# EAGLE schematic XOrduino2 (EAGLE 6.2)

## Sheet 1 of 2
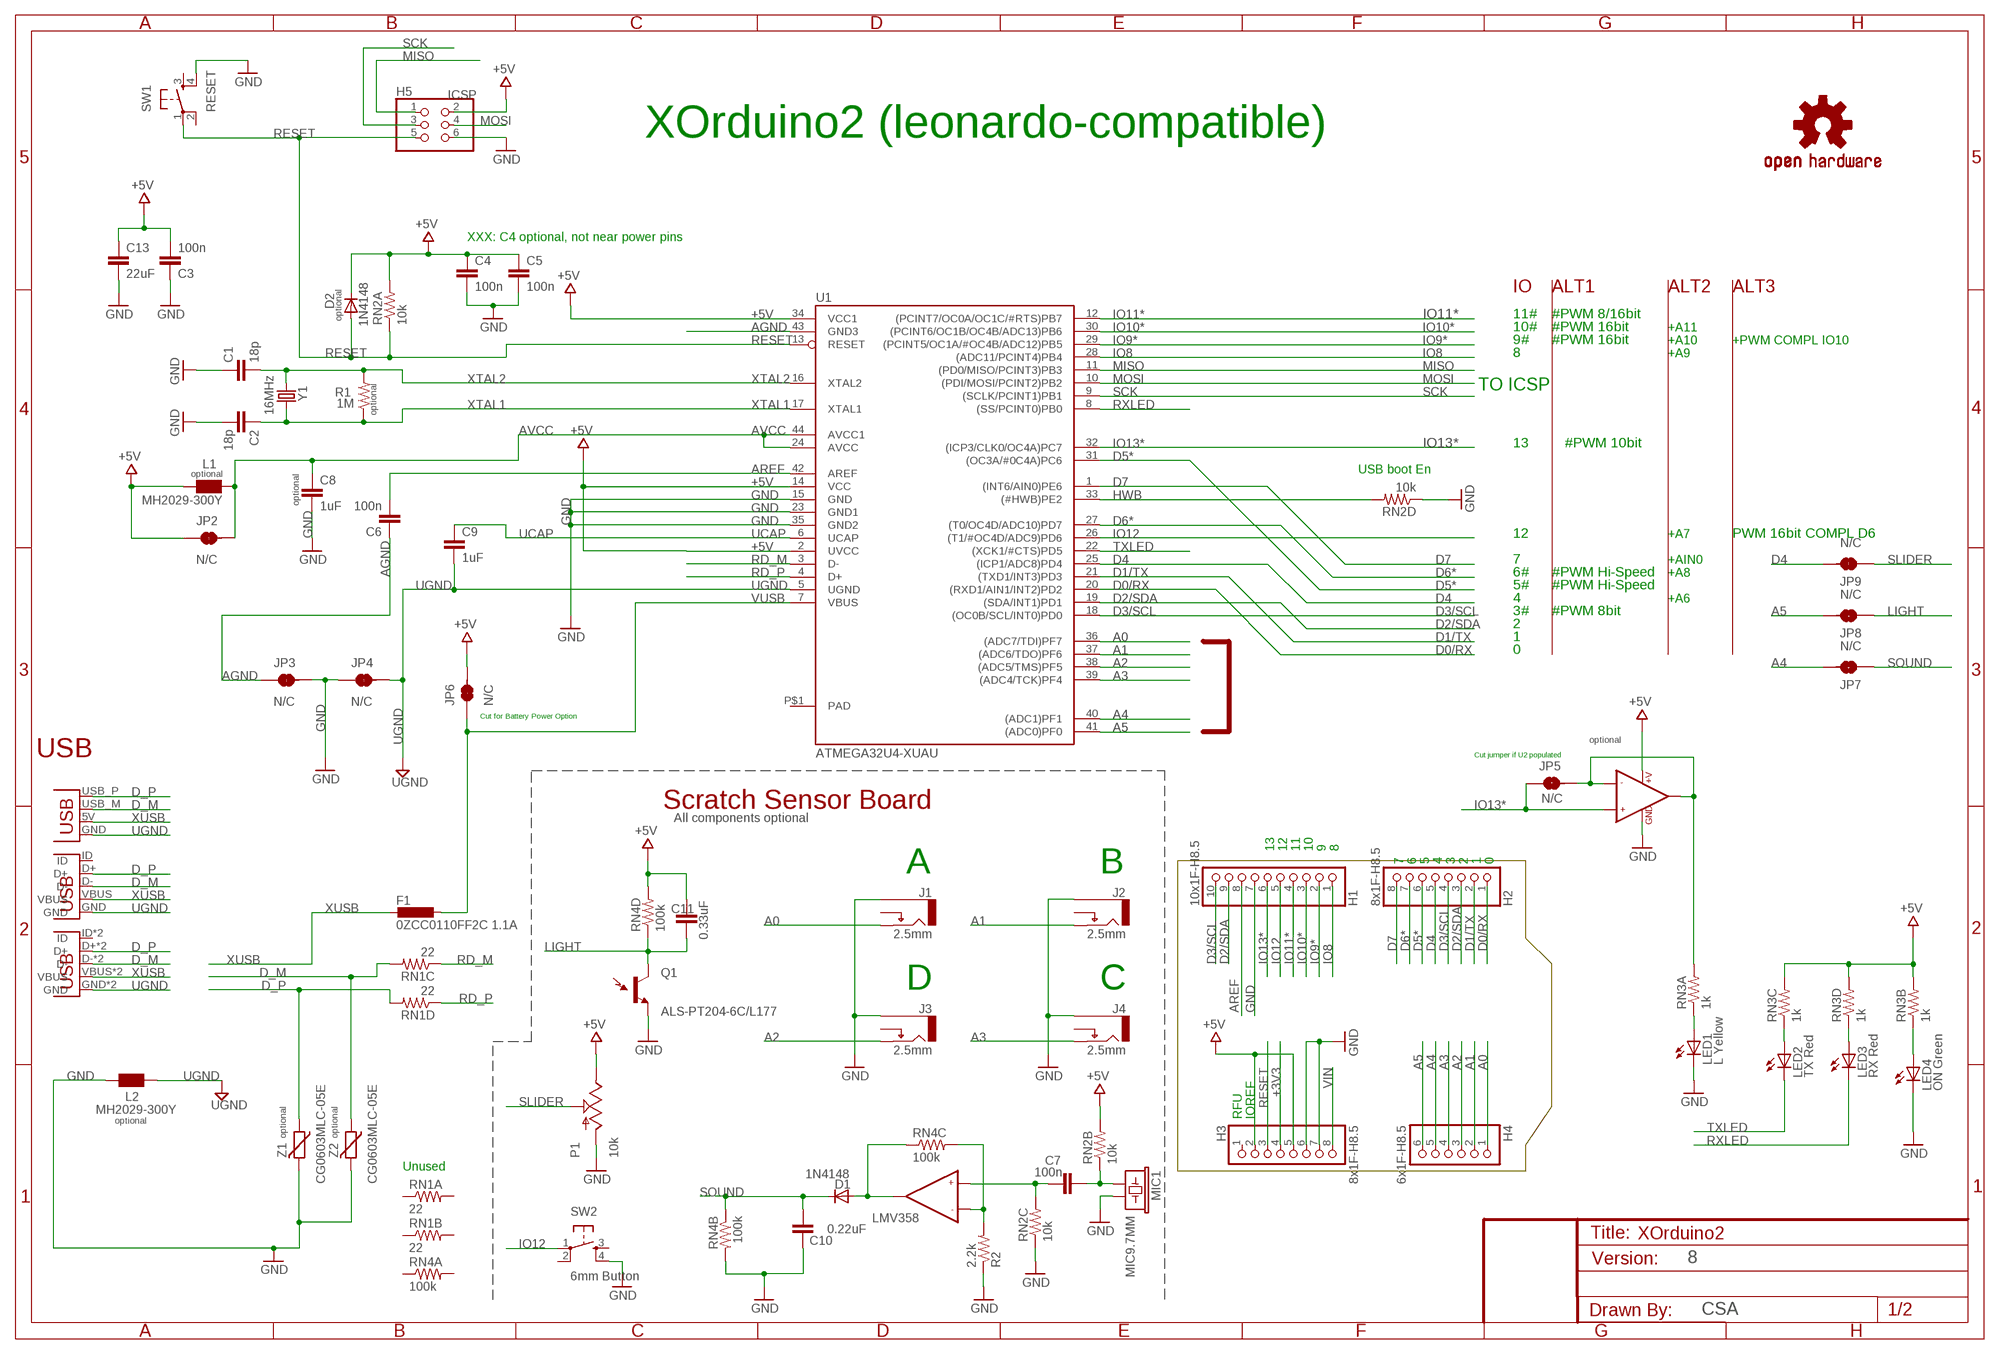
[diagram p0: schematic, sheet 1]

### Parts
C1  18p  CAP0805  [0805]
C2  18p  CAP0805  [0805]
C3  100n  CAP0805  [0805]
C4  100n  CAP0805  [0805]
C5  100n  CAP0805  [0805]
C6  100n  CAP0805  [0805]
C7  100n  CAP0805  [0805]
C8  1uF  CAP0805  [0805]
C9  1uF  CAP0805  [0805]
C10  0.22uF  CAP0805  [0805]
C11  0.33uF  CAP0805  [0805]
C13  22uF  CAP1206  [1206]
D1  1N4148  DIODE1N4148  [DIODE-1N4148]
D2  1N4148  DIODE1N4148  [DIODE-1N4148]
F1  0ZCC0110FF2C 1.1A  L-EUL1812  [L1812]
H1  10x1F-H8.5  PINHD-1X10  [1X10]
H2  8x1F-H8.5  PINHD-1X8  [1X08]
H3  8x1F-H8.5  PINHD-1X8  [1X08]
H4  6x1F-H8.5  PINHD-1X6  [1X06]
H5  ICSP  PINHD-2X3  [2X03]
J1  2.5mm  AUDIO-JACK  [MJ-3523-SMT]
J2  2.5mm  AUDIO-JACK  [MJ-3523-SMT]
J3  2.5mm  AUDIO-JACK  [MJ-3523-SMT]
J4  2.5mm  AUDIO-JACK  [MJ-3523-SMT]
JP2  N/C  SOLDERJUMPERNOCONFLICT  [SJ-2S-TRACE-NOCONFLICT]
JP3  N/C  SOLDERJUMPERNOCONFLICT  [SJ-2S-TRACE-NOCONFLICT]
JP4  N/C  SOLDERJUMPERNOCONFLICT  [SJ-2S-TRACE-NOCONFLICT]
JP5  N/C  SOLDERJUMPERNOCONFLICT  [SJ-2S-TRACE-NOCONFLICT]
JP6  N/C  SOLDERJUMPERNOCONFLICT  [SJ-2S-TRACE-NOCONFLICT]
JP7  N/C  SOLDERJUMPERBOT-VIA-NOCONFLICT  [SJ-2S-BOT-TRACE-VIA-NOCONFLICT]
JP8  N/C  SOLDERJUMPERBOT-VIA-NOCONFLICT  [SJ-2S-BOT-TRACE-VIA-NOCONFLICT]
JP9  N/C  SOLDERJUMPERBOT-NOCONFLICT  [SJ-2S-BOT-TRACE-NOCONFLICT]
L1  MH2029-300Y  WE-CBF_0805  [0805]
L2  MH2029-300Y  WE-CBF_0805  [0805]
LED1  L Yellow  LED0805  [LED0805]
LED2  TX Red  LED0805  [LED0805]
LED3  RX Red  LED0805  [LED0805]
LED4  ON Green  LED0805  [LED0805]
MIC1  MIC9.7MM  [MIC-9.7MM]
P1  10k  POT  [P091N]
Q1  ALS-PT204-6C/L177  [LED3MM-KIT]
R1  1M  RESISTOR0805-RES  [0805]
R2  2.2k  RESISTOR0805-RES  [0805]
RN1  22  RESISTOR-ARRAYCRA06S  [CRA06S]
RN2  10k  RESISTOR-ARRAYCRA06S  [CRA06S]
RN3  1k  RESISTOR-ARRAYCRA06S  [CRA06S]
RN4  100k  RESISTOR-ARRAYCRA06S  [CRA06S]
SW1  RESET  TAC_SWITCHPTH  [TACTILE-PTH]
SW2  6mm Button  TAC_SWITCHPTH  [TACTILE-PTH]
U1  ATMEGA32U4-XUAU  [TQFP44-PAD]
U2  LMV358  [SO08]
U$5  OSHW-LOGOL  [OSHW-LOGO-L]
X1  USBPCB  [USB-A-PCB]
X2  USBMINIB  [USB-MB-H2]
X3  USBMICROB-VIA  [USB-MICROB-VIA]
Y1  16MHz  CRYSTALHC49US  [HC49US]
Z1  CG0603MLC-05E  VARISTORCN0603  [CT/CN0603]
Z2  CG0603MLC-05E  VARISTORCN0603  [CT/CN0603]

### Nets
+3V3: H3.4
+5V [power]: C3.2 C4.1 C5.1 C11.1 C13.1 D2.C H3.2 H3.5 H5.2 JP2.1 JP6.2 L1.1 P1.1(E) RN2.7 RN2.8 RN3.5 RN3.6 RN3.7 RN4.5 U1.2(UVCC) U1.14(VCC) U1.34(VCC1) U2.8(+V) ; also sheet 2
A0: H4.1 J1.2(TIP) U1.36((ADC7/TDI)PF7)
A1: H4.2 J2.2(TIP) U1.37((ADC6/TDO)PF6)
A2: H4.3 J3.2(TIP) U1.38((ADC5/TMS)PF5)
A3: H4.4 J4.2(TIP) U1.39((ADC4/TCK)PF4)
A4: H4.5 JP7.2 U1.40((ADC1)PF1)
A5: H4.6 JP8.2 U1.41((ADC0)PF0)
AGND: C6.1 JP3.1 U1.43(GND3)
AREF [aref]: C6.2 H1.8 U1.42(AREF)
AVCC: C8.1 JP2.2 L1.2 U1.24(AVCC) U1.44(AVCC1)
D0/RX: H2.1 U1.20((RXD1/AIN1/INT2)PD2) ; also sheet 2
D1/TX: H2.2 U1.21((TXD1/INT3)PD3) ; also sheet 2
D2/SDA: H1.9 H2.3 U1.19((SDA/INT1)PD1) ; also sheet 2
D3/SCL: H1.10 H2.4 U1.18((OC0B/SCL/INT0)PD0)
D4: H2.5 JP9.2 U1.25((ICP1/ADC8)PD4)
D5*: H2.6 U1.31((OC3A/#0C4A)PC6) ; also sheet 2
D6*: H2.7 U1.27((T0/OC4D/ADC10)PD7) ; also sheet 2
D7: H2.8 U1.1((INT6/AIN0)PE6) ; also sheet 2
D_M: RN1.6 X1.USB_M(D-) X2.D- X3.D- X3.D-_VIA(D-) Z2.1
D_P: RN1.5 X1.USB_P(D+) X2.D+ X3.D+ X3.D+_VIA(D+) Z1.1
GND [gnd]: C1.1 C2.2 C3.1 C4.2 C5.2 C8.2 C10.1 C13.2 H1.7 H3.6 H3.7 H5.6 J1.1(SLEEVE) J2.1(SLEEVE) J3.1(SLEEVE) J4.1(SLEEVE) JP3.2 JP4.1 L2.2 LED1.C LED4.C MIC1.2 P1.3(A) Q1.A(E1) R2.1 RN2.3 RN2.4 RN4.7 SW1.4 SW2.4 U1.15(GND) U1.23(GND1) U1.35(GND2) U2.4(GND) Z1.2 Z2.2 ; also sheet 2
HWB: RN2.5 U1.33((#HWB)PE2)
IO8: H1.1 U1.28((ADC11/PCINT4)PB4) ; also sheet 2
IO9*: H1.2 U1.29((PCINT5/OC1A/#OC4B/ADC12)PB5) ; also sheet 2
IO10*: H1.3 U1.30((PCINT6/OC1B/OC4B/ADC13)PB6) ; also sheet 2
IO11*: H1.4 U1.12((PCINT7/OC0A/OC1C/#RTS)PB7) ; also sheet 2
IO12: H1.5 SW2.1 U1.26((T1/#OC4D/ADC9)PD6)
IO13*: H1.6 JP5.1 U1.32((ICP3/CLK0/OC4A)PC7) U2.3(+IN1)
IO13_MIRROR: JP5.2 RN3.8 U2.1(OUT1) U2.2(-IN1)
LED1_ANODE: LED1.A RN3.1
LED2_ANODE: LED2.A RN3.3
LED3_ANODE: LED3.A RN3.4
LED4_ANODE: LED4.A RN3.2
LIGHT: C11.2 JP8.1 JP8.VIA6 Q1.K(C1) RN4.4
MIC_IN: C7.1 MIC1.1 RN2.2
MISO: H5.1 U1.11((PD0/MISO/PCINT3)PB3)
MOSI: H5.4 U1.10((PDI/MOSI/PCINT2)PB2)
OPAMP1_M: R2.2 RN4.6 U2.6(-IN2)
OPAMP1_OUT: D1.A RN4.3 U2.7(OUT2)
OPAMP1_P: C7.2 RN2.6 U2.5(+IN2)
RD_M: RN1.3 U1.3(D-)
RD_P: RN1.4 U1.4(D+)
RESET: D2.A H3.3 H5.5 RN2.1 SW1.1 U1.13(RESET)
RXLED: LED3.C U1.8((SS/PCINT0)PB0)
SCK: H5.3 U1.9((SCLK/PCINT1)PB1)
SLIDER: JP9.1 P1.2(S)
SOUND: C10.2 D1.C JP7.1 JP7.VIA6 RN4.2
TXLED: LED2.C U1.22((XCK1/#CTS)PD5)
UCAP: C9.1 U1.6(UCAP)
UGND [gnd]: C9.2 JP4.2 L2.1 U1.5(UGND) X1.GND X2.GND X3.GND X3.GND_VIA(GND)
VIN [power]: H3.8 ; also sheet 2
VUSB [power]: F1.1 JP6.1 U1.7(VBUS) ; also sheet 2
XTAL1: C2.1 R1.1 U1.17(XTAL1) Y1.2
XTAL2: C1.2 R1.2 U1.16(XTAL2) Y1.1
XUSB [usbvcc]: F1.2 X1.5V(VBUS) X2.VBUS X3.VBUS X3.VBUS_VIA(VBUS)
Unconnected: H3.1 J1.10(SW) J2.10(SW) J3.10(SW) J4.10(SW) RN1.1 RN1.2 RN1.7 RN1.8 RN4.1 RN4.8 SW1.2 SW1.3 SW2.2 SW2.3 X2.ID X3.ID X3.ID_VIA(ID)

### Notes on the sheet
- XOrduino2 (leonardo-compatible)
- XXX: C4 optional, not near power pins
- IO | ALT1 | ALT2 | ALT3
- optional | 11# | #PWM 8/16bit
- 10# | #PWM 16bit | +A11
- 9# | #PWM 16bit | +A10 | +PWM COMPL IO10
- 8 | +A9
- TO ICSP
- optional
- 13 | #PWM 10bit
- USB boot En
- optional
- optional
- 12 | +A7 | PWM 16bit COMPL D6
- 7 | +AIN0
- 6# | #PWM Hi-Speed | +A8
- 5# | #PWM Hi-Speed
- 4 | +A6
- 3# | #PWM 8bit
- 2
- 1
- 0
- Cut for Battery Power Option
- optional
- USB | Cut jumper if U2 populated
- Scratch Sensor Board
- All components optional
- 13 | 12 | 11 | 10 | 9 | 8
- 7 | 6 | 5 | 4 | 3 | 2 | 1 | 0
- A | B
- D | C
- RFU | IOREF
- optional
- optional | optional
- Unused
- LMV358
- 8
- CSA

## Sheet 2 of 2
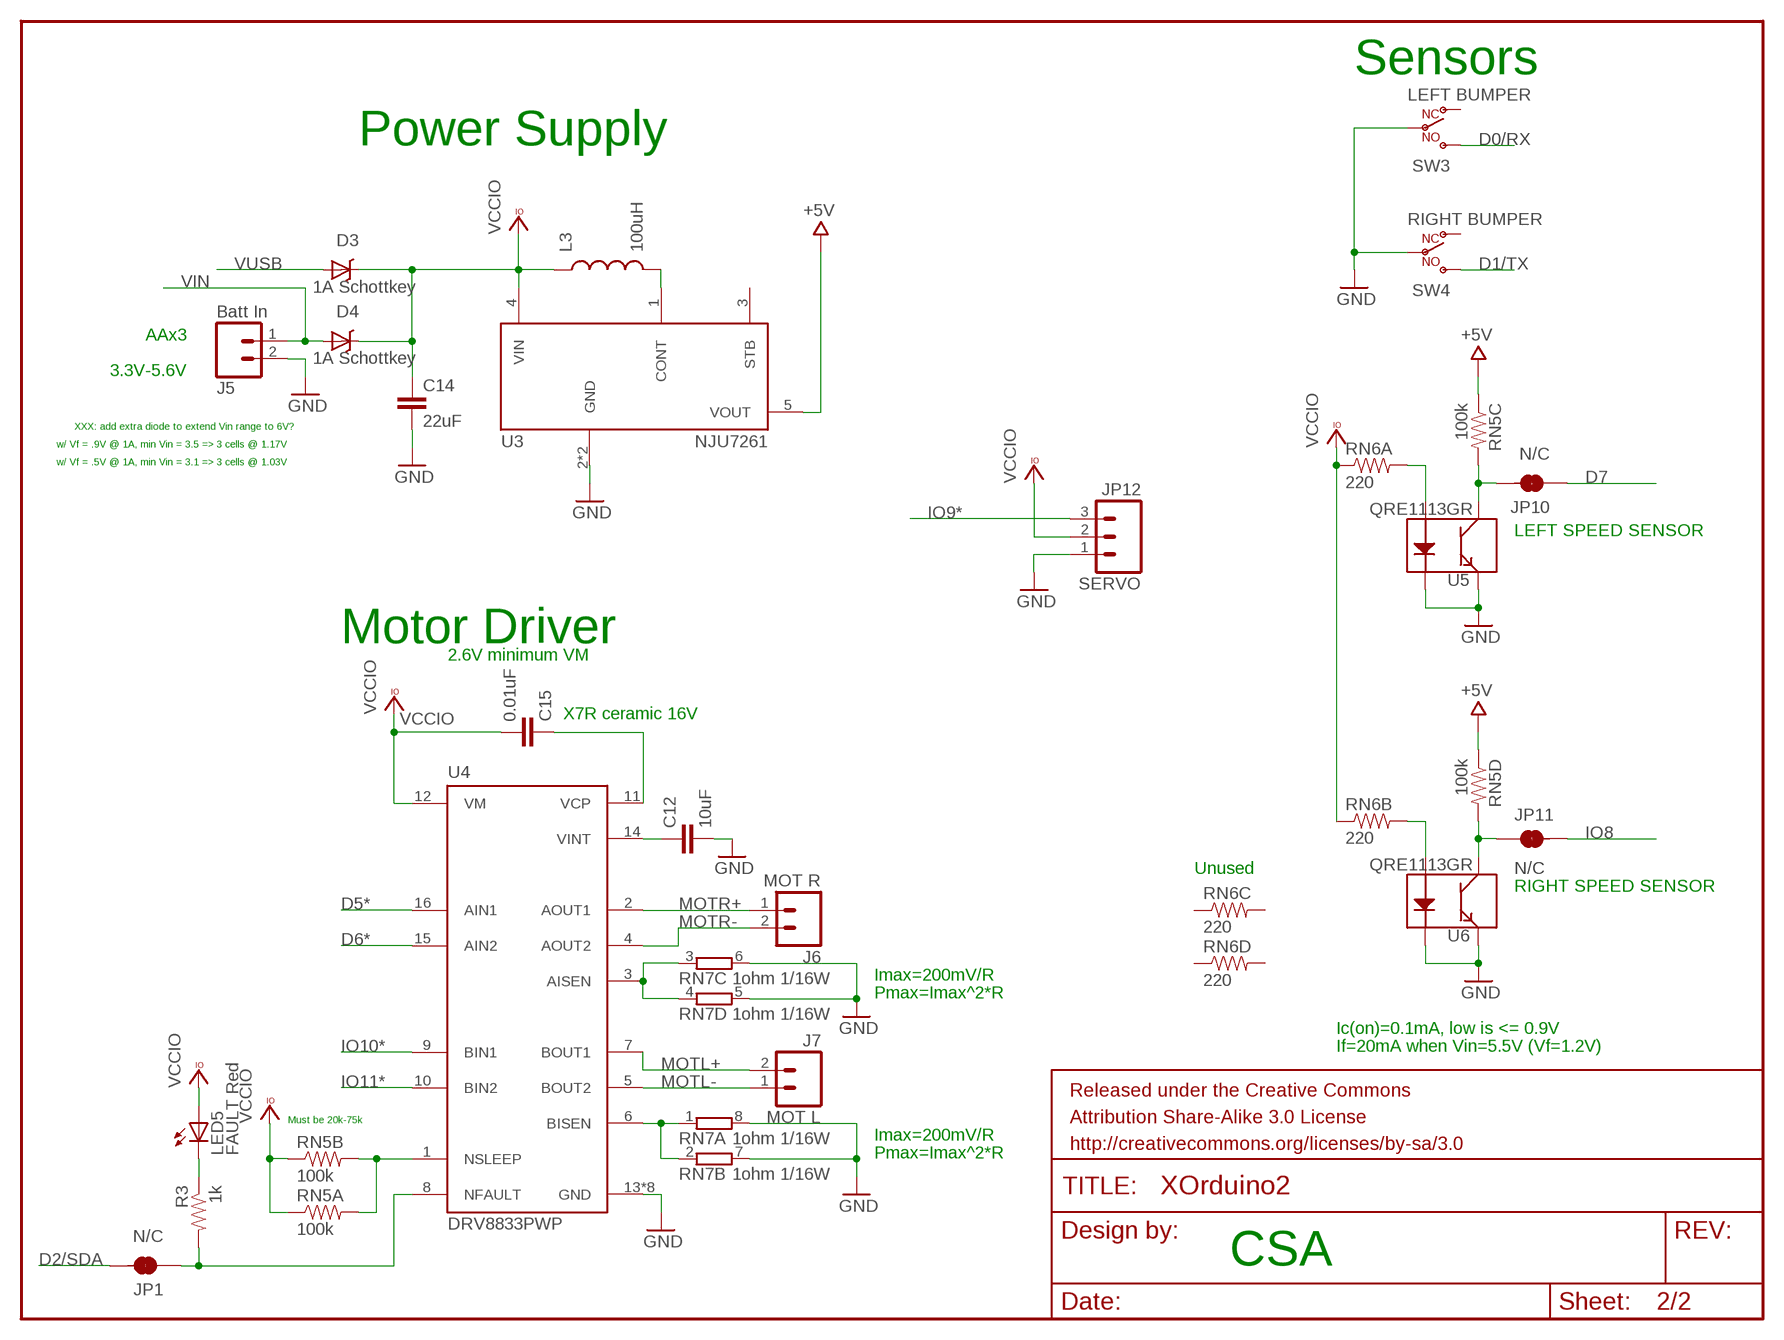
[diagram p1: schematic, sheet 2]

### Parts
C12  10uF  CAP0805  [0805]
C14  22uF  CAP1206  [1206]
C15  0.01uF  CAP0805  [0805]
D3  1A Schottkey  DIODE-SCHOTTKY_  [SMA-DIODE]
D4  1A Schottkey  DIODE-SCHOTTKY_  [SMA-DIODE]
J5  Batt In  M02PTH  [1X02]
J6  MOT R  M023.5MM  [SCREWTERMINAL-3.5MM-2]
J7  MOT L  M023.5MM  [SCREWTERMINAL-3.5MM-2]
JP1  N/C  SOLDERJUMPERNOCONFLICT  [SJ-2S-TRACE-NOCONFLICT]
JP10  N/C  SOLDERJUMPERBOT-VIA-NOCONFLICT  [SJ-2S-BOT-TRACE-VIA-NOCONFLICT]
JP11  N/C  SOLDERJUMPERBOT-VIA-NOCONFLICT  [SJ-2S-BOT-TRACE-VIA-NOCONFLICT]
JP12  SERVO  M03PTH  [1X03]
L3  100uH  INDUCTOR1007  [1007]
LED5  FAULT Red  LED0805  [LED0805]
R3  1k  RESISTOR0805-RES  [0805]
RN5  100k  RESISTOR-ARRAYCRA06S  [CRA06S]
RN6  220  RESISTOR-ARRAYCRA06S  [CRA06S]
RN7  1ohm 1/16W  4R-NEXB38V  [EXB38V]
SW3  LEFT BUMPER  SWITCH-SPDTV1-NOHOLES  [SW-LEVER-V1-NOHOLES]
SW4  RIGHT BUMPER  SWITCH-SPDTV2-NOHOLES  [SW-LEVER-V2-NOHOLES]
U3  NJU7261  [SOT89-5]
U4  DRV8833PWP  [PWP16]
U5  QRE1113GR  [QRE1113GR]
U6  QRE1113GR  [QRE1113GR]

### Nets
+5V [power]: RN5.3 RN5.4 U3.5(VOUT) ; also sheet 1
D0/RX: SW3.NO ; also sheet 1
D1/TX: SW4.NO ; also sheet 1
D2/SDA: JP1.2 ; also sheet 1
D5*: U4.16(AIN1) ; also sheet 1
D6*: U4.15(AIN2) ; also sheet 1
D7: JP10.1 JP10.VIA6 ; also sheet 1
GND [gnd]: C12.2 C14.2 J5.2 JP12.1 RN7.5 RN7.6 RN7.7 RN7.8 SW3.C SW4.C U3.2(GND) U3.VIA1(GND) U4.13(GND) U4.PPAD(GND) U4.VIA1(GND) U4.VIA2(GND) U4.VIA3(GND) U4.VIA4(GND) U4.VIA5(GND) U4.VIA6(GND) U5.2(K) U5.4(E) U6.2(K) U6.4(E) ; also sheet 1
IO8: JP11.2 ; also sheet 1
IO9*: JP12.3 ; also sheet 1
IO10*: U4.9(BIN1) ; also sheet 1
IO11*: U4.10(BIN2) ; also sheet 1
LED5_CATHODE: LED5.C R3.1
MOTL+: J7.2 U4.7(BOUT1)
MOTL-: J7.1 U4.5(BOUT2)
MOTR+: J6.1 U4.2(AOUT1)
MOTR-: J6.2 U4.4(AOUT2)
U3_CONT: L3.2 U3.1(CONT)
U4_AISEN: RN7.3 RN7.4 U4.3(AISEN)
U4_BISEN: RN7.1 RN7.2 U4.6(BISEN)
U4_NFAULT: JP1.1 R3.2 U4.8(NFAULT)
U4_NSLEEP: RN5.7 RN5.8 U4.1(NSLEEP)
U4_VCP: C15.1 U4.11(VCP)
U4_VINT: C12.1 U4.14(VINT)
U5_ANODE: RN6.8 U5.1(A)
U5_COLLECTOR: JP10.2 RN5.6 U5.3(C)
U6_ANODE: RN6.7 U6.1(A)
U6_COLLECTOR: JP11.1 JP11.VIA6 RN5.5 U6.3(C)
VCCIO: C14.1 C15.2 D3.C D4.C JP12.2 L3.1 LED5.A RN5.1 RN5.2 RN6.1 RN6.2 U3.4(VIN) U4.12(VM)
VIN [power]: D4.A J5.1 ; also sheet 1
VUSB [power]: D3.A ; also sheet 1
Unconnected: RN6.3 RN6.4 RN6.5 RN6.6 SW3.NC SW4.NC U3.3(STB)

### Notes on the sheet
- Sensors
- Power Supply
- AAx3
- 3.3V-5.6V
- XXX: add extra diode to extend Vin range to 6V?
- w/ Vf = .9V @ 1A, min Vin = 3.5 => 3 cells @ 1.17V
- w/ Vf = .5V @ 1A, min Vin = 3.1 => 3 cells @ 1.03V
- LEFT SPEED SENSOR
- Motor Driver
- 2.6V minimum VM
- X7R ceramic 16V
- Unused
- RIGHT SPEED SENSOR
- Imax=200mV/R
- Pmax=Imax^2*R
- Ic(on)=0.1mA, low is <= 0.9V
- If=20mA when Vin=5.5V (Vf=1.2V)
- Must be 20k-75k
- Imax=200mV/R
- Pmax=Imax^2*R
- CSA

## Power pins joined to a net without a drawn wire
PAD: U1.P$1(PAD)

## Library data of the parts
C1-C15 = SparkFun-Passives:CAP: Capacitor Standard 0603 ceramic capacitor, and 0.1" leaded capacitor.
D1 D2 = SparkFun-DiscreteSemi:DIODE: Diode These are standard reverse protection diodes and small signal diodes. SMA package can handle up to about 1A. SOD-323 can handle about 200mA. What the SOD-323 package when ordering, there are some mfgs out there that are 5-pin packages.
D3 D4 = SparkFun-DiscreteSemi:DIODE-SCHOTTKY: Commonly MBRA140.
F1 = rcl:L-EU: INDUCTOR, European symbol
H1 = SmartPrj:PINHD-1X10: PIN HEADER
H2 H3 = SmartPrj:PINHD-1X8: PIN HEADER
H4 = SmartPrj:PINHD-1X6: PIN HEADER
H5 = SmartPrj:PINHD-2X3: PIN HEADER
J1-J4 = xorduino:AUDIO-JACK: 3.5 SMT audio jack mono w/ switch
J5 = SparkFun-Connectors:M02: Header 2 Standard 2-pin 0.1" header. Use with straight break away headers (SKU : PRT-00116), right angle break away headers (PRT-00553), swiss pins (PRT-00743), machine pins (PRT-00117), and female headers (PRT-00115). Molex polarized connector foot print use with SKU : PRT-08233 with associated crimp pins and housings.
J6 J7 = SparkFun:M02: Header 2 Standard 2-pin 0.1" header. Use with straight break away headers (SKU : PRT-00116), right angle break away headers (PRT-00553), swiss pins (PRT-00743), machine pins (PRT-00117), and female headers (PRT-00115). Molex polarized connector foot print use with SKU : PRT-08233 with associated crimp pins and housings.
JP1-JP11 = xorduino:SOLDERJUMPER
JP12 = SparkFun-Connectors:M03: Header 3 Standard 3-pin 0.1" header. Use with straight break away headers (SKU : PRT-00116), right angle break away headers (PRT-00553), swiss pins (PRT-00743), machine pins (PRT-00117), and female headers (PRT-00115). Molex polarized connector foot print use with SKU : PRT-08232 with associated crimp pins and housings.
L1 L2 = wuerth-elektronik:WE-CBF: SMD EMI Suppression Ferrite Beads - excellent anti-EMI properties - low DCR - impedances till 3000 ohms - rated current up to 6 A
L3 = SparkFun-Passives:INDUCTOR: Inductors Basic Inductor/Choke - 0603 and 1206. Footprints are not proven and vary greatly between part numbers.
LED1-LED5 = xorduino:LED
MIC1 = SparkFun:MIC: Microphone Omni-directional electret microphone. 9.7mm standard diameter.
P1 = xorduino:POT
Q1 = xorduino:ALS-PT204-6C/L177: Ambient light sensor.
R1-R3 = SparkFun-Passives:RESISTOR: Resistor Basic schematic elements and footprints for 0603, 1206, and PTH resistors.
RN1-RN6 = xorduino:RESISTOR-ARRAY
RN7 = resistor-dil:4R-N: Array Chip Resistor Source: RS Component / Phycomp; OC_FARNELL: unknown; OC_NEWARK: unknown
SW1 SW2 = SparkFun-Electromechanical:TAC_SWITCH: Momentary Switch Button commonly used for reset or general input. Spark Fun Electronics SKU : COM-00097
SW3 SW4 = xorduino:SWITCH-SPDT: SPDT switch.
U1 = SmartPrj:ATMEGA32U4-XU
U2 = SparkFun:LMV358
U3 = xorduino:NJU7261: CMOS Step-Up Switching Regulator.
U4 = xorduino:DRV8833
U5 U6 = xorduino:QRE1113: Fairchild QRE1113 Miniature Reflective Object Sensor
U$5 = SparkFun-Aesthetics:OSHW-LOGO: Open Source Hardware Logo This logo indicates the piece of hardware it is found on incorporates a OSHW license and/or adheres to the definition of open source hardware found here: http://freedomdefined.org/OSHW
X1 = SparkFun-Connectors:USB: USB Connectors USB-B-PTH is fully proven SKU : PRT-00139 USB-miniB is fully proven SKU : PRT-00587 USB-A-PCB is untested. USB-A-H is throughly reviewed, but untested. Spark Fun Electronics SKU : PRT-00437 USB-B-SMT is throughly reviewed, but untested. Needs silkscreen touching up. USB-A-S has not been used/tested USB-MB-H has not been used/tested
X2 X3 = xorduino:USB
Y1 = SparkFun-FreqCtrl:CRYSTAL: Various standard crystals. Proven footprints. Spark Fun Electronics SKU : COM-00534
Z1 Z2 = varistor:VARISTOR: VARISTOR

## Net classes
0 default: width 0.203 mm, drill 0.406 mm, clearance 0.203 mm
1 power: width 0.203 mm, drill 0.406 mm, clearance 0.203 mm
2 gnd: width 0.203 mm, drill 0.406 mm, clearance 0.203 mm
3 usbvcc: width 0.203 mm, drill 0.406 mm, clearance 0.203 mm
4 aref: width 0.203 mm, drill 0.406 mm, clearance 0.203 mm